# Altium schematic sheet FlexEMG_v0r0_SF2-POWER.SchDoc
size A3
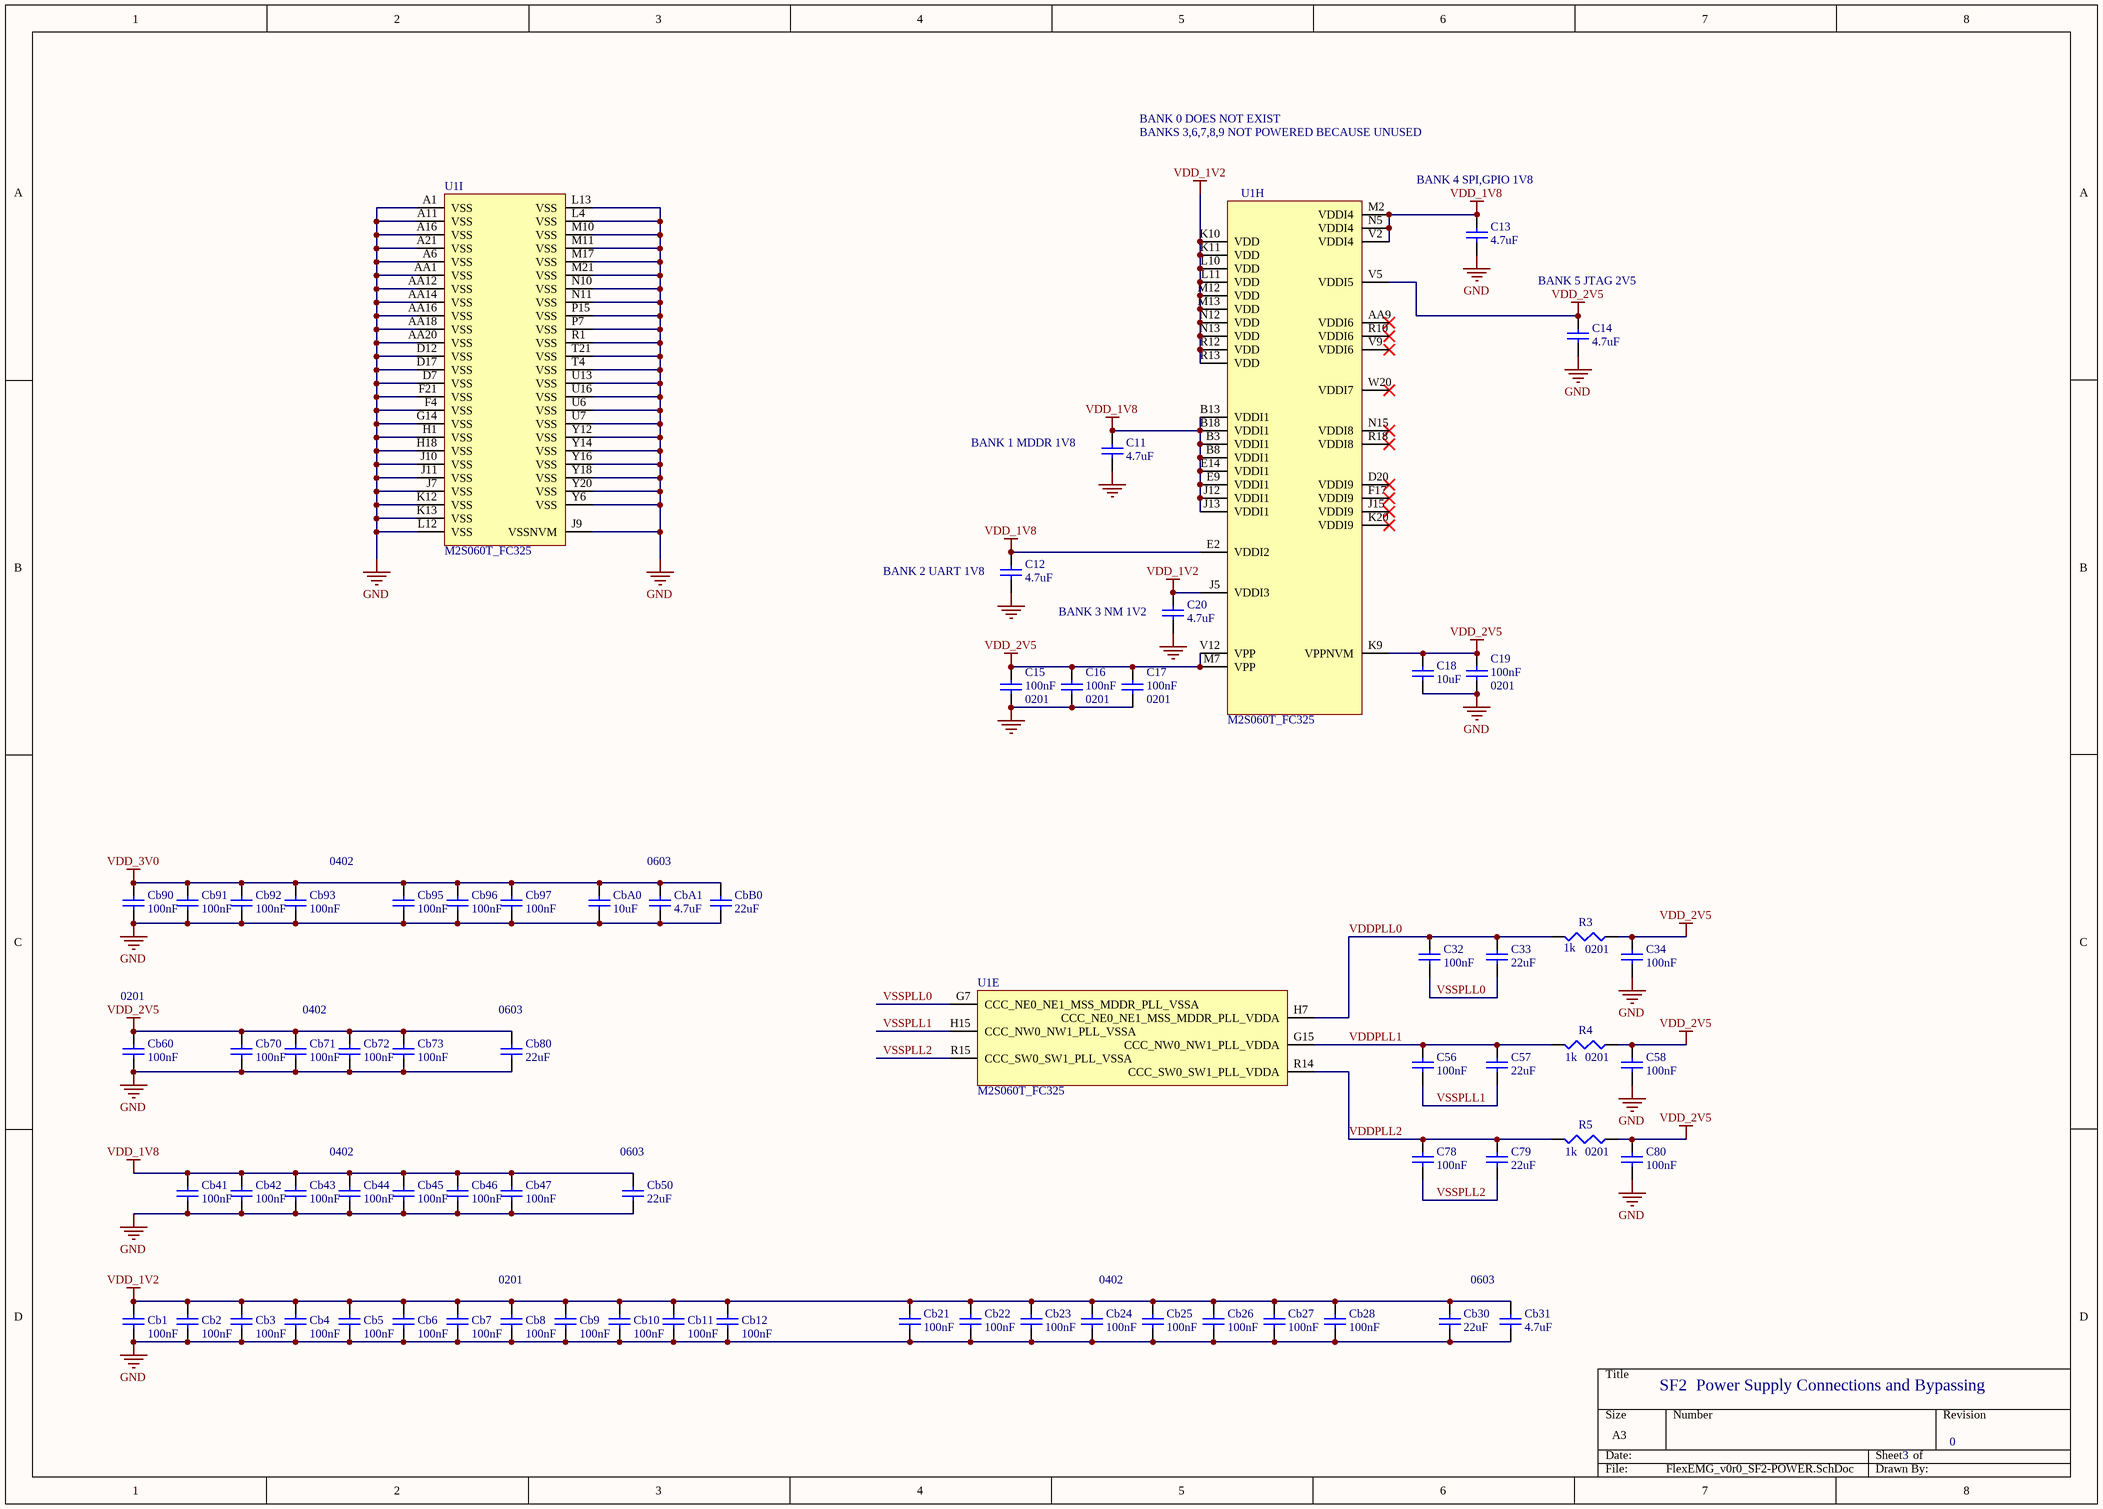
[diagram p0: FlexEMG_v0r0_SF2-POWER.SchDoc]

## Parts
C11  value 4.7uF  [c0603-Murata-GR]  (hidden comment: GRM188R6YA475KE15D)
C12  value 4.7uF  [c0603-Murata-GR]  (hidden comment: GRM188R6YA475KE15D)
C13  value 4.7uF  [c0603-Murata-GR]  (hidden comment: GRM188R6YA475KE15D)
C14  value 4.7uF  [c0603-Murata-GR]  (hidden comment: GRM188R6YA475KE15D)
C15  value 100nF  Package: 0201  [c0201-Murata-GR]  (hidden comment: GRM033R6YA104KE14D)
C16  value 100nF  Package: 0201  [c0201-Murata-GR]  (hidden comment: GRM033R6YA104KE14D)
C17  value 100nF  Package: 0201  [c0201-Murata-GR]  (hidden comment: GRM033R6YA104KE14D)
C18  value 10uF  [c0603-Murata-GR]  (hidden comment: GRM188R61E106MA73D)
C19  value 100nF  Package: 0201  [c0201-Murata-GR]  (hidden comment: GRM033R6YA104KE14D)
C20  value 4.7uF  [c0603-Murata-GR]  (hidden comment: GRM188R6YA475KE15D)
C32  value 100nF  [c0402-Murata-GR]  (hidden comment: GRM155R61H104KE19D)
C33  value 22uF  [c0603-Murata-GR]  (hidden comment: GRM187R61A226ME15D)
C34  value 100nF  [c0402-Murata-GR]  (hidden comment: GRM155R61H104KE19D)
C56  value 100nF  [c0402-Murata-GR]  (hidden comment: GRM155R61H104KE19D)
C57  value 22uF  [c0603-Murata-GR]  (hidden comment: GRM187R61A226ME15D)
C58  value 100nF  [c0402-Murata-GR]  (hidden comment: GRM155R61H104KE19D)
C78  value 100nF  [c0402-Murata-GR]  (hidden comment: GRM155R61H104KE19D)
C79  value 22uF  [c0603-Murata-GR]  (hidden comment: GRM187R61A226ME15D)
C80  value 100nF  [c0402-Murata-GR]  (hidden comment: GRM155R61H104KE19D)
Cb1  value 100nF  [c0201-Murata-GR]  (hidden comment: GRM033R6YA104KE14D)
Cb2  value 100nF  [c0201-Murata-GR]  (hidden comment: GRM033R6YA104KE14D)
Cb3  value 100nF  [c0201-Murata-GR]  (hidden comment: GRM033R6YA104KE14D)
Cb4  value 100nF  [c0201-Murata-GR]  (hidden comment: GRM033R6YA104KE14D)
Cb5  value 100nF  [c0201-Murata-GR]  (hidden comment: GRM033R6YA104KE14D)
Cb6  value 100nF  [c0201-Murata-GR]  (hidden comment: GRM033R6YA104KE14D)
Cb7  value 100nF  [c0201-Murata-GR]  (hidden comment: GRM033R6YA104KE14D)
Cb8  value 100nF  [c0201-Murata-GR]  (hidden comment: GRM033R6YA104KE14D)
Cb9  value 100nF  [c0201-Murata-GR]  (hidden comment: GRM033R6YA104KE14D)
Cb10  value 100nF  [c0201-Murata-GR]  (hidden comment: GRM033R6YA104KE14D)
Cb11  value 100nF  [c0201-Murata-GR]  (hidden comment: GRM033R6YA104KE14D)
Cb12  value 100nF  [c0201-Murata-GR]  (hidden comment: GRM033R6YA104KE14D)
Cb21  value 100nF  [c0402-Murata-GR]  (hidden comment: GRM155R61H104KE19D)
Cb22  value 100nF  [c0402-Murata-GR]  (hidden comment: GRM155R61H104KE19D)
Cb23  value 100nF  [c0402-Murata-GR]  (hidden comment: GRM155R61H104KE19D)
Cb24  value 100nF  [c0402-Murata-GR]  (hidden comment: GRM155R61H104KE19D)
Cb25  value 100nF  [c0402-Murata-GR]  (hidden comment: GRM155R61H104KE19D)
Cb26  value 100nF  [c0402-Murata-GR]  (hidden comment: GRM155R61H104KE19D)
Cb27  value 100nF  [c0402-Murata-GR]  (hidden comment: GRM155R61H104KE19D)
Cb28  value 100nF  [c0402-Murata-GR]  (hidden comment: GRM155R61H104KE19D)
Cb30  value 22uF  [c0603-Murata-GR]  (hidden comment: GRM187R61A226ME15D)
Cb31  value 4.7uF  [c0603-Murata-GR]  (hidden comment: GRM188R6YA475KE15D)
Cb41  value 100nF  [c0402-Murata-GR]  (hidden comment: GRM155R61H104KE19D)
Cb42  value 100nF  [c0402-Murata-GR]  (hidden comment: GRM155R61H104KE19D)
Cb43  value 100nF  [c0402-Murata-GR]  (hidden comment: GRM155R61H104KE19D)
Cb44  value 100nF  [c0402-Murata-GR]  (hidden comment: GRM155R61H104KE19D)
Cb45  value 100nF  [c0402-Murata-GR]  (hidden comment: GRM155R61H104KE19D)
Cb46  value 100nF  [c0402-Murata-GR]  (hidden comment: GRM155R61H104KE19D)
Cb47  value 100nF  [c0402-Murata-GR]  (hidden comment: GRM155R61H104KE19D)
Cb50  value 22uF  [c0603-Murata-GR]  (hidden comment: GRM187R61A226ME15D)
Cb60  value 100nF  [c0201-Murata-GR]  (hidden comment: GRM033R6YA104KE14D)
Cb70  value 100nF  [c0402-Murata-GR]  (hidden comment: GRM155R61H104KE19D)
Cb71  value 100nF  [c0402-Murata-GR]  (hidden comment: GRM155R61H104KE19D)
Cb72  value 100nF  [c0402-Murata-GR]  (hidden comment: GRM155R61H104KE19D)
Cb73  value 100nF  [c0402-Murata-GR]  (hidden comment: GRM155R61H104KE19D)
Cb80  value 22uF  [c0603-Murata-GR]  (hidden comment: GRM187R61A226ME15D)
Cb90  value 100nF  [c0402-Murata-GR]  (hidden comment: GRM155R61H104KE19D)
Cb91  value 100nF  [c0402-Murata-GR]  (hidden comment: GRM155R61H104KE19D)
Cb92  value 100nF  [c0402-Murata-GR]  (hidden comment: GRM155R61H104KE19D)
Cb93  value 100nF  [c0402-Murata-GR]  (hidden comment: GRM155R61H104KE19D)
Cb95  value 100nF  [c0402-Murata-GR]  (hidden comment: GRM155R61H104KE19D)
Cb96  value 100nF  [c0402-Murata-GR]  (hidden comment: GRM155R61H104KE19D)
Cb97  value 100nF  [c0402-Murata-GR]  (hidden comment: GRM155R61H104KE19D)
CbA0  value 10uF  [c0603-Murata-GR]  (hidden comment: GRM188R61E106MA73D)
CbA1  value 4.7uF  [c0603-Murata-GR]  (hidden comment: GRM188R6YA475KE15D)
CbB0  value 22uF  [c0603-Murata-GR]  (hidden comment: GRM187R61A226ME15D)
R3  value 1k  Package: 0201  [0201_p]  (hidden comment: ERJ-1GEF1001C)
R4  value 1k  Package: 0201  [0201_p]  (hidden comment: ERJ-1GEF1001C)
R5  value 1k  Package: 0201  [0201_p]  (hidden comment: ERJ-1GEF1001C)
U1  M2S060T_FC325  [MCSM-CS-325]  (parts E,H,I of 9)

## Nets
GND: C11.1 C12.1 C13.1 C14.1 C15.1 C16.1 C17.1 C18.1 C19.1 C20.1 C34.1 C58.1 C80.1 Cb1.1 Cb2.1 Cb3.1 Cb4.1 Cb5.1 Cb6.1 Cb7.1 Cb8.1 Cb9.1 Cb10.1 Cb11.1 Cb12.1 Cb21.1 Cb22.1 Cb23.1 Cb24.1 Cb25.1 Cb26.1 Cb27.1 Cb28.1 Cb30.1 Cb31.1 Cb41.1 Cb42.1 Cb43.1 Cb44.1 Cb45.1 Cb46.1 Cb47.1 Cb50.1 Cb60.1 Cb70.1 Cb71.1 Cb72.1 Cb73.1 Cb80.1 Cb90.1 Cb91.1 Cb92.1 Cb93.1 Cb95.1 Cb96.1 Cb97.1 CbA0.1 CbA1.1 CbB0.1 U1.A1(VSS) U1.A6(VSS) U1.A11(VSS) U1.A16(VSS) U1.A21(VSS) U1.AA1(VSS) U1.AA12(VSS) U1.AA14(VSS) U1.AA16(VSS) U1.AA18(VSS) U1.AA20(VSS) U1.D7(VSS) U1.D12(VSS) U1.D17(VSS) U1.F4(VSS) U1.F21(VSS) U1.G14(VSS) U1.H1(VSS) U1.H18(VSS) U1.J7(VSS) U1.J9(VSSNVM) U1.J10(VSS) U1.J11(VSS) U1.K12(VSS) U1.K13(VSS) U1.L4(VSS) U1.L12(VSS) U1.L13(VSS) U1.M10(VSS) U1.M11(VSS) U1.M17(VSS) U1.M21(VSS) U1.N10(VSS) U1.N11(VSS) U1.P7(VSS) U1.P15(VSS) U1.R1(VSS) U1.T4(VSS) U1.T21(VSS) U1.U6(VSS) U1.U7(VSS) U1.U13(VSS) U1.U16(VSS) U1.Y6(VSS) U1.Y12(VSS) U1.Y14(VSS) U1.Y16(VSS) U1.Y18(VSS) U1.Y20(VSS)
VDD_1V2: C20.2 Cb1.2 Cb2.2 Cb3.2 Cb4.2 Cb5.2 Cb6.2 Cb7.2 Cb8.2 Cb9.2 Cb10.2 Cb11.2 Cb12.2 Cb21.2 Cb22.2 Cb23.2 Cb24.2 Cb25.2 Cb26.2 Cb27.2 Cb28.2 Cb30.2 Cb31.2 U1.J5(VDDI3) U1.K10(VDD) U1.K11(VDD) U1.L10(VDD) U1.L11(VDD) U1.M12(VDD) U1.M13(VDD) U1.N12(VDD) U1.N13(VDD) U1.R12(VDD) U1.R13(VDD)
VDD_1V8: C11.2 C12.2 C13.2 Cb41.2 Cb42.2 Cb43.2 Cb44.2 Cb45.2 Cb46.2 Cb47.2 Cb50.2 U1.B3(VDDI1) U1.B8(VDDI1) U1.B13(VDDI1) U1.B18(VDDI1) U1.E2(VDDI2) U1.E9(VDDI1) U1.E14(VDDI1) U1.J12(VDDI1) U1.J13(VDDI1) U1.M2(VDDI4) U1.N5(VDDI4) U1.V2(VDDI4)
VDD_2V5: C14.2 C15.2 C16.2 C17.2 C18.2 C19.2 C34.2 C58.2 C80.2 Cb60.2 Cb70.2 Cb71.2 Cb72.2 Cb73.2 Cb80.2 R3.1 R4.1 R5.1 U1.K9(VPPNVM) U1.M7(VPP) U1.V5(VDDI5) U1.V12(VPP)
VDD_3V0: Cb90.2 Cb91.2 Cb92.2 Cb93.2 Cb95.2 Cb96.2 Cb97.2 CbA0.2 CbA1.2 CbB0.2
VDDPLL0: C32.2 C33.2 R3.2 U1.H7(CCC_NE0_NE1_MSS_MDDR_PLL_VDDA)
VDDPLL1: C56.2 C57.2 R4.2 U1.G15(CCC_NW0_NW1_PLL_VDDA)
VDDPLL2: C78.2 C79.2 R5.2 U1.R14(CCC_SW0_SW1_PLL_VDDA)
VSSPLL0: C32.1 C33.1 U1.G7(CCC_NE0_NE1_MSS_MDDR_PLL_VSSA)
VSSPLL1: C56.1 C57.1 U1.H15(CCC_NW0_NW1_PLL_VSSA)
VSSPLL2: C78.1 C79.1 U1.R15(CCC_SW0_SW1_PLL_VSSA)

Not connected (* = marked no-connect by the designer): U1 AA9(VDDI6)* D20(VDDI9)* F17(VDDI9)* J15(VDDI9)* K20(VDDI9)* N15(VDDI8)* R10(VDDI6)* R18(VDDI8)* V9(VDDI6)* W20(VDDI7)*

## Notes on the sheet
- BANKS 3,6,7,8,9 NOT POWERED BECAUSE UNUSED
- BANK 0 DOES NOT EXIST
- BANK 4 SPI,GPIO 1V8
- (near C14) BANK 5 JTAG 2V5
- (near C11) BANK 1 MDDR 1V8
- (near C12) BANK 2 UART 1V8
- BANK 3 NM 1V2
- 0402
- (near CbA1) 0603
- (near Cb60) 0201
- (near Cb80) 0603
- (near Cb50) 0603
- (near Cb8) 0201
- 0603
- SF2  Power Supply Connections and Bypassing
- 3
- 0

## Library data of the parts
C11-C14 C20 Cb31 CbA1 = Cap: CAP CER 4.7UF 35V X5R 0603; Manufacturer: Murata; Supplier: Digikey; Supplier PN: 490-7205-1-ND; Manufacturer PN: GRM188R6YA475KE15D
C15-C17 C19 Cb1-Cb12 Cb60 = Cap: CAP CER 0.1UF 16V X7S 0201; Manufacturer: Murata; Note: 35V 10% X5R; Supplier PN: 490-10430-1-ND; Supplier: Digikey; Manufacturer PN: GRM033R6YA104KE14D
C18 CbA0 = Cap: CAP CER 10UF 25V X5R 0603 20%; Manufacturer: Murata; Supplier: Digikey; Supplier PN: 490-7202-1-ND; Manufacturer PN: GRM188R61E106MA73D
C32 C34 C56 C58 C78 C80 Cb21-Cb28 Cb41-Cb47 Cb70-Cb73 Cb90-Cb93 Cb95-Cb97 = Cap: CAP CER 0.1UF 50V X5R 0402; Manufacturer: Murata; Supplier: Digikey; Manufacturer PN: GRM155R61H104KE19D; Supplier PN: 490-11917-1-ND
C33 C57 C79 Cb30 Cb50 Cb80 CbB0 = Cap: CAP CER 22UF 10V X5R 0603; Manufacturer: Murata; Note: 10V X5R 20%; Supplier: Digikey; Supplier PN: 490-13243-1-ND; Manufacturer PN: GRM187R61A226ME15D
R3-R5 = Resistor: RES SMD 1K OHM 1% 1/20W 0201; Manufacturer: Panasonic; Manufacturer PN: ERJ-1GEF1001C; Supplier: Digikey; Supplier P/N: P1.00KABCT-ND; Power: 1/20W
U1 = M2S060T_FC325: SmartFusion2; Manufacturer PN: M2S060T-CS325; Manufacturer: Microsemi; Supplier: Future; Supplier PN: M2S060T-FCSG325I